# Altium project MainBoard_V1_2.PrjPcb
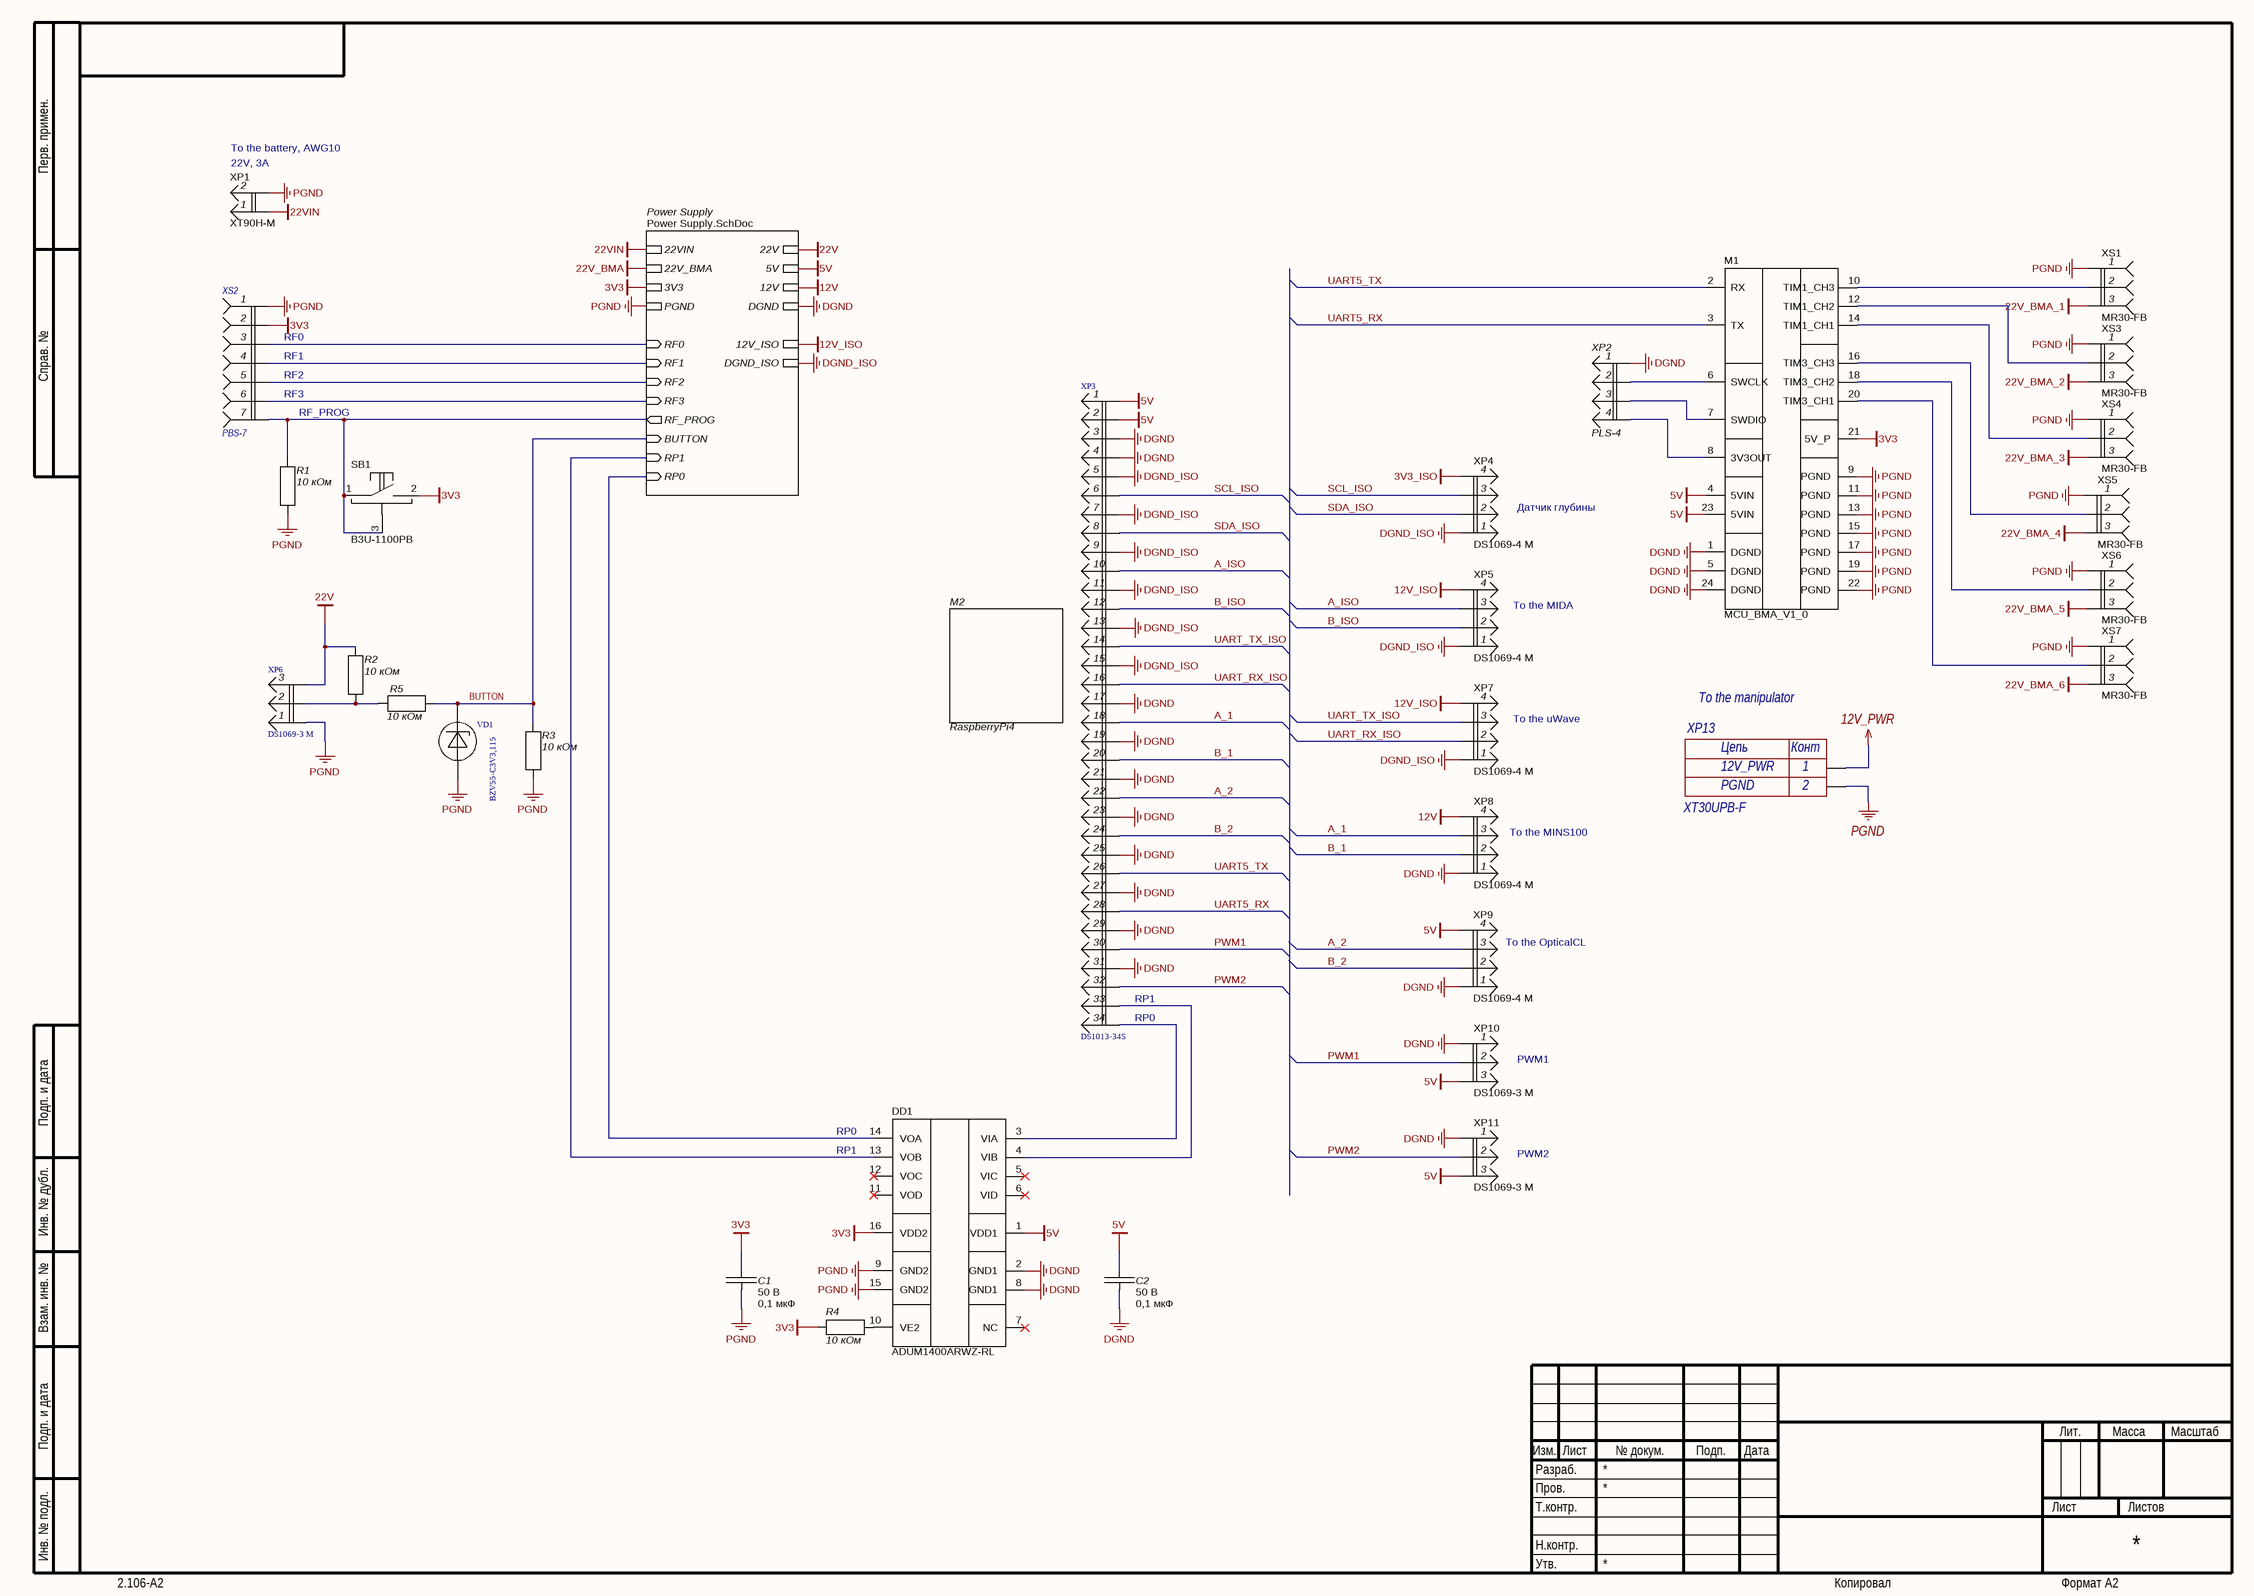
[diagram p0: Main.SchDoc]
2 sheets, 100 parts. Net scope: hierarchical (ports join the sheet entries above them; power ports are global).
Board file: MainBoard_V1_2.PcbDoc
Sheets:
  Main.SchDoc
    Power Supply = Power Supply.SchDoc

## Sheet Main.SchDoc
size 594 x 420 mm; Organization: Altium Limited; Address1: L3, 12a Rodborough Rd; Address2: Frenchs Forest; Address3: NSW; Address4: Australia 2086

### Parts
C1  Voltage: 50 В  [C0603C]  (hidden comment: 0,1 мкФ)
C2  Voltage: 50 В  [C0603C]  (hidden comment: 0,1 мкФ)
DD1  ADUM1400ARWZ-RL  [SOIC-Wide-16]
M1  MCU_BMA_V1_0  [MCU_BMA_V1_0]
M2  RaspberryPi4  [Raspberry+PI4MB_HAT_V2]
R1  10 кОм  [C0603R]
R2  10 кОм  [C0603R]
R3  10 кОм  [C0603R]
R4  10 кОм  [C0603R]
R5  10 кОм  [C0603R]
SB1  B3U-1100PB  [B3U-1100P]
VD1  BZV55-C3V3,115  [SOD80C]
XP1  XT90H-M  [XT90H-M]
XP2  PLS-4  [PLS-4]
XP3  DS1013-34S  [IDC-34MS]
XP4  DS1069-4 M  [DS1069-4 M]
XP5  DS1069-4 M  [DS1069-4 M]
XP6  DS1069-3 M  [DS1069-3 M]
XP7  DS1069-4 M  [DS1069-4 M]
XP8  DS1069-4 M  [DS1069-4 M]
XP9  DS1069-4 M  [DS1069-4 M]
XP10  DS1069-3 M  [DS1069-3 M]
XP11  DS1069-3 M  [DS1069-3 M]
XP13  XT30UPB-F  Value2: PGND  Value1: 12V_PWR  [XT30UPB-F]
XS1  MR30-FB  [MR30-FB]
XS2  PBS-7  [PBS-7]
XS3  MR30-FB  [MR30-FB]
XS4  MR30-FB  [MR30-FB]
XS5  MR30-FB  [MR30-FB]
XS6  MR30-FB  [MR30-FB]
XS7  MR30-FB  [MR30-FB]

### Sub-sheets
Power Supply = Power Supply.SchDoc: 22VIN, 22V, PGND, DGND, DGND_ISO, 12V, 5V, 12V_ISO, RF1 (in), RF2 (in), RF3 (in), BUTTON (in), RP1 (in), RP0 (in), 3V3, RF0 (in), 22V_BMA, RF_PROG (out)

### Nets
3V3: C1.1 DD1.16(VDD2) M1.21(5V_P) R4.2 SB1.2 XS2.2 ; sheet Power Supply/3V3
3V3_ISO: XP4.4
5V: C2.1 DD1.1(VDD1) M1.4(5VIN) M1.23(5VIN) XP3.1 XP3.2 XP9.4 XP10.3 XP11.3 ; sheet Power Supply/5V
12V: XP8.4 ; sheet Power Supply/12V
12V_ISO: XP5.4 XP7.4 ; sheet Power Supply/12V_ISO
12V_PWR: XP13.P
22V: R2.1 XP6.3 ; sheet Power Supply/22V
22V_BMA: sheet Power Supply/22V_BMA
22V_BMA_1: XS1.3
22V_BMA_2: XS3.3
22V_BMA_3: XS4.3
22V_BMA_4: XS5.3
22V_BMA_5: XS6.3
22V_BMA_6: XS7.3
22VIN: XP1.1 ; sheet Power Supply/22VIN
DGND: C2.2 DD1.2(GND1) DD1.8(GND1) M1.1(DGND) M1.5(DGND) M1.24(DGND) XP2.1 XP3.3 XP3.4 XP3.17 XP3.19 XP3.21 XP3.23 XP3.25 XP3.27 XP3.29 XP3.31 XP8.1 XP9.1 XP10.1 XP11.1 ; sheet Power Supply/DGND
DGND_ISO: XP3.5 XP3.7 XP3.9 XP3.11 XP3.13 XP3.15 XP4.1 XP5.1 XP7.1 ; sheet Power Supply/DGND_ISO
PGND: C1.2 DD1.9(GND2) DD1.15(GND2) M1.9(PGND) M1.11(PGND) M1.13(PGND) M1.15(PGND) M1.17(PGND) M1.19(PGND) M1.22(PGND) R1.2 R3.2 VD1.2(ANODE) XP1.2 XP6.1 XP13.N XS1.1 XS2.1 XS3.1 XS4.1 XS5.1 XS6.1 XS7.1 ; sheet Power Supply/PGND
A_1: XP3.18 XP8.3
A_2: XP3.22 XP9.3
A_ISO: XP3.10 XP5.3
B_1: XP3.20 XP8.2
B_2: XP3.24 XP9.2
B_ISO: XP3.12 XP5.2
BUTTON: R3.1 R5.2 VD1.1(CATHODE) ; sheet Power Supply/BUTTON
PWM1: XP3.30 XP10.2
PWM2: XP3.32 XP11.2
RF0: XS2.3 ; sheet Power Supply/RF0
RF1: XS2.4 ; sheet Power Supply/RF1
RF2: XS2.5 ; sheet Power Supply/RF2
RF3: XS2.6 ; sheet Power Supply/RF3
RF_PROG: R1.1 SB1.1 SB1.3 XS2.7 ; sheet Power Supply/RF_PROG
RP0: DD1.14(VOA) ; sheet Power Supply/RP0
RP1: DD1.13(VOB) ; sheet Power Supply/RP1
SCL_ISO: XP3.6 XP4.3
SDA_ISO: XP3.8 XP4.2
UART5_RX: M1.3(TX) XP3.28
UART5_TX: M1.2(RX) XP3.26
UART_RX_ISO: XP3.16 XP7.2
UART_TX_ISO: XP3.14 XP7.3
NetDD1_3: DD1.3(VIA) XP3.34
NetDD1_4: DD1.4(VIB) XP3.33
NetDD1_10: DD1.10(VE2) R4.1
NetM1_6: M1.6(SWCLK) XP2.2
NetM1_7: M1.7(SWDIO) XP2.3
NetM1_8: M1.8(3V3OUT) XP2.4
NetM1_10: M1.10(TIM1_CH3) XS1.2
NetM1_12: M1.12(TIM1_CH2) XS3.2
NetM1_14: M1.14(TIM1_CH1) XS4.2
NetM1_16: M1.16(TIM3_CH3) XS5.2
NetM1_18: M1.18(TIM3_CH2) XS6.2
NetM1_20: M1.20(TIM3_CH1) XS7.2
NetR2_2: R2.2 R5.1 XP6.2

Not connected (* = marked no-connect by the designer): DD1 5(VIC)* 6(VID)* 7(NC)* 11(VOD)* 12(VOC)*

### Notes on the sheet
- (near XP1) To the battery, AWG10
- (near XP1) 22V, 3A
- RF0
- RF1
- RF2
- RF3
- RF_PROG
- (near XP4) Датчик глубины
- (near XP5) To the MIDA
- (near XP7) To the uWave
- To the manipulator
- (near XP8) To the MINS100
- (near XP9) To the OpticalCL
- RP1
- RP0
- (near XP10) PWM1
- (near XP11) PWM2
- Перв. примен.
- Справ. №
- Подп. и дата
- Инв. № дубл.
- Взам. инв. №
- Разраб.
- Изм.
- Лист
- № докум.
- Подп.
- Дата
- Лит.
- Масса
- Масштаб
- Пров.
- Т.контр.
- Листов
- Инв. № подл.
- Утв.
- Н.контр.
- 2.106-A2
- Копировал
- Формат А2
- (in symbol XT30UPB-F) Цепь; Конт; 1; 2

### Library data of the parts
C1 C2 = CC0603KRX7R9BB104: SMD 0603 ; X7R; 0,1 мкФ; 50 В; Manufacturer: YAGEO; Persent: ±5%; Type: Ceramic; Part Number: CC0603KRX7R9BB104; Package: SMD 0603; Dielectric: X7R; ComponentLink1Description: Datasheet; Value: 0,1 мкФ
DD1 = ADUM1400ARWZ-RL: ISO; Manufacturer: Analog Devices; Part Number: ADUM1400ARWZ-RL; Type: ISO
M1 = MCU_BMA_V1_0: MCU_BMA_V1_0, user module; Type: User
M2 = Raspberry+PI4MB_HAT_V2: Part Number: RaspberryPi4; Type: User; ComponentLink1Description: Datasheet; Manufacturer: Raspberry
R1-R5 = RC0603FR-0710KL: SMD 0603; 0,1; 1%; 10 кОм; Manufacturer: Yageo; Power: 0,1; Part Number: RC0603FR-0710KL; Package: SMD 0603; Persent: 1%; Value: 10 кОм; Category: R
SB1 = B3U-1100PB: SB; Manufacturer: OMRON; Part Number: B3U-1100PB; Type: SB
VD1 = BZV55-C3V3,115: Zener, 3,3В; Manufacturer: Nexperia; Part Number: BZV55-C3V3,115; Type: Zener
XP1 = XT90H-M: Manufacturer: AMASS; Part Number: XT90H-M; Type: XT
XP3 = DS1013-34S: IDC; Manufacturer: Connfly; Part Number: DS1013-34S; Type: IDC
XP4 XP5 XP7-XP9 = DS1069-4 M: Manufacturer: Connfly; Part Number: DS1069-4 M; Type: XH
XP6 XP10 XP11 = DS1069-3 M: Manufacturer: Connfly; Part Number: DS1069-3 M; Type: XH
XP13 = XT30UPB-F: 30 А (15 продолжительно), прямая мать; Part Number: XT30UPB-F
XS1 XS3-XS7 = MR30-FB: Manufacturer: AMASS; Part Number: MR30-FB; Type: XT
XP2 = PLS-4: Part Number: PLS-4; Type: PLS; ComponentLink1Description: Datasheet; Manufacturer: -
XS2 = PBS-7: Part Number: PBS-7; Type: PBS; ComponentLink1Description: Datasheet; Manufacturer: -

## Sheet Power Supply.SchDoc
size A1; Organization: Altium Limited; Address1: L3, 12a Rodborough Rd; Address2: Frenchs Forest; Address3: NSW; Address4: Australia 2086
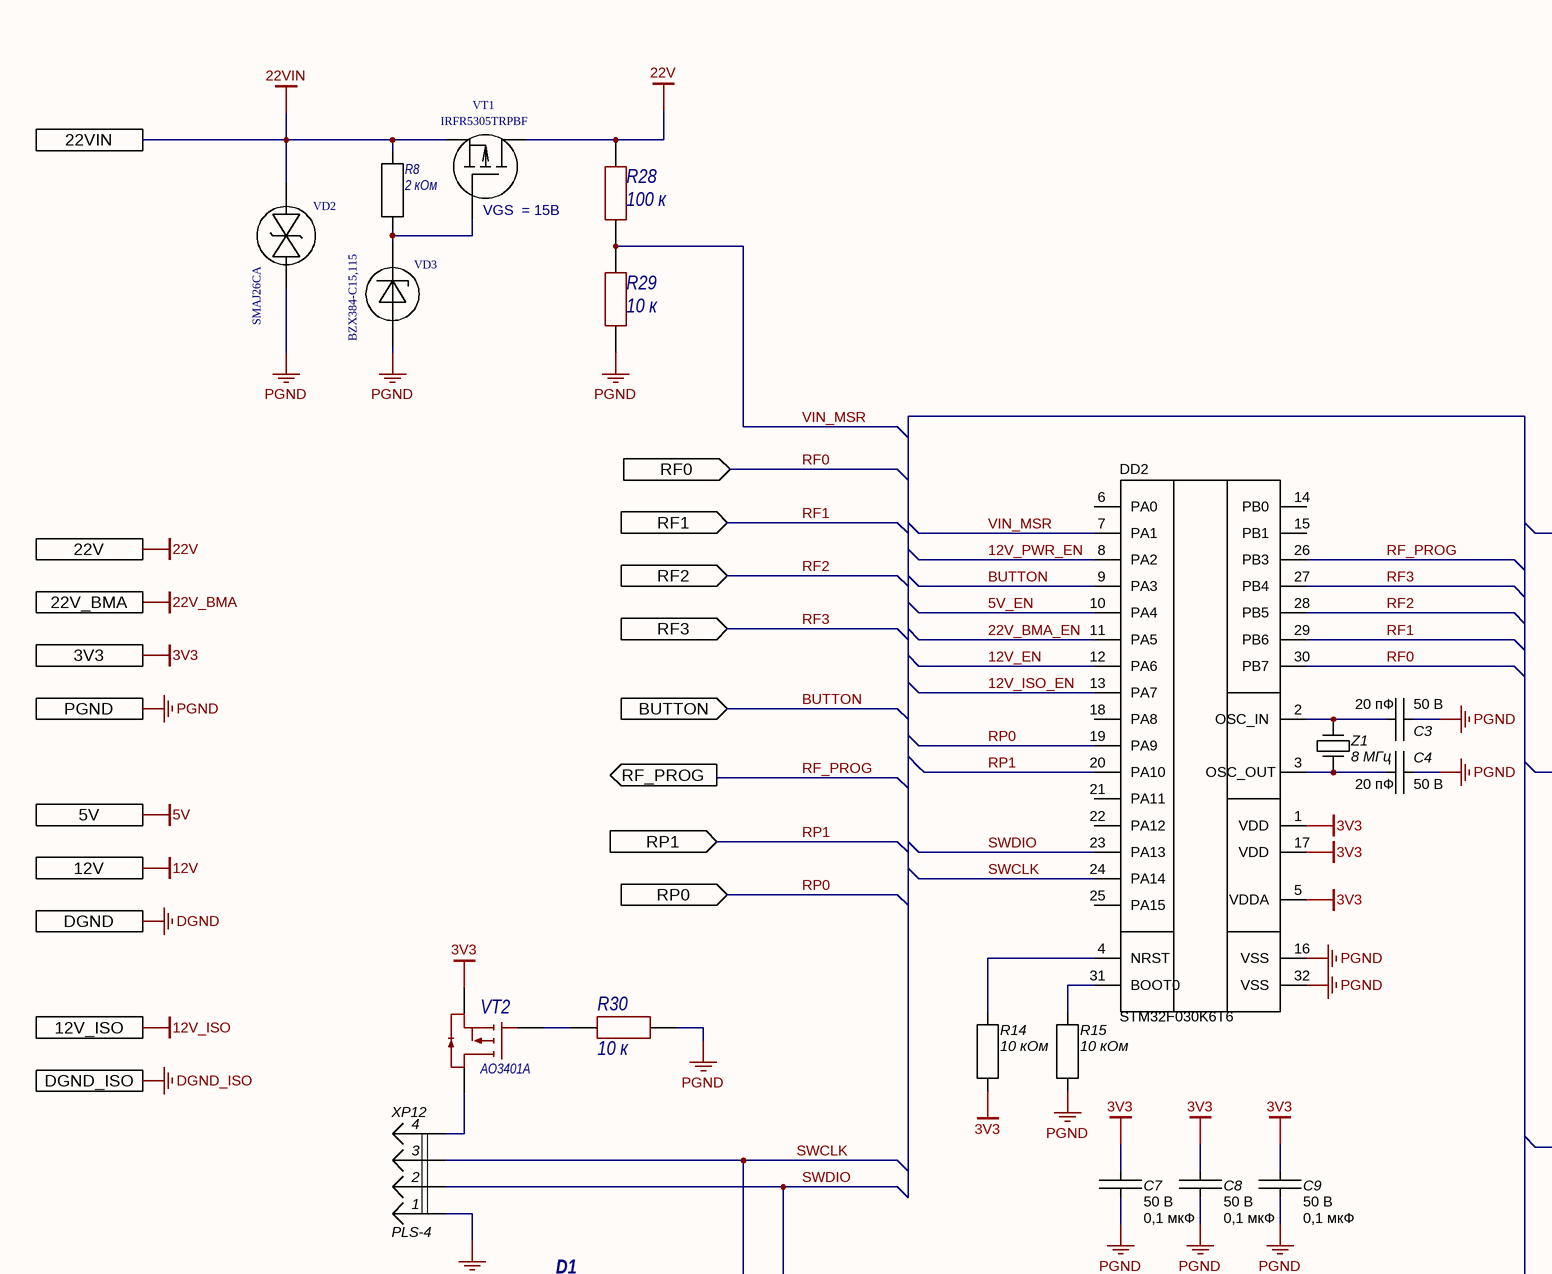
[diagram p1: Power Supply.SchDoc, top left]
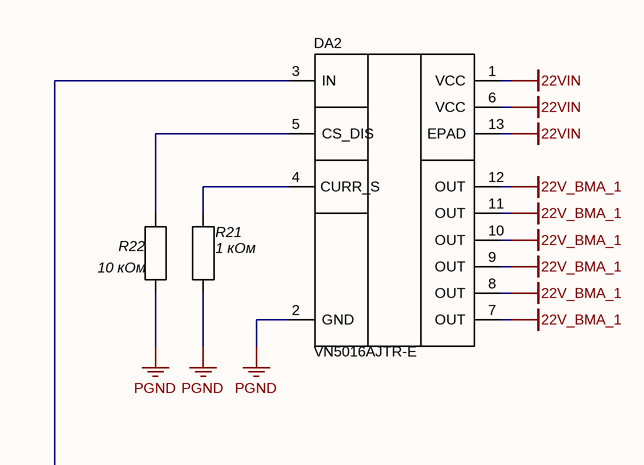
[diagram p2: Power Supply.SchDoc, top right]
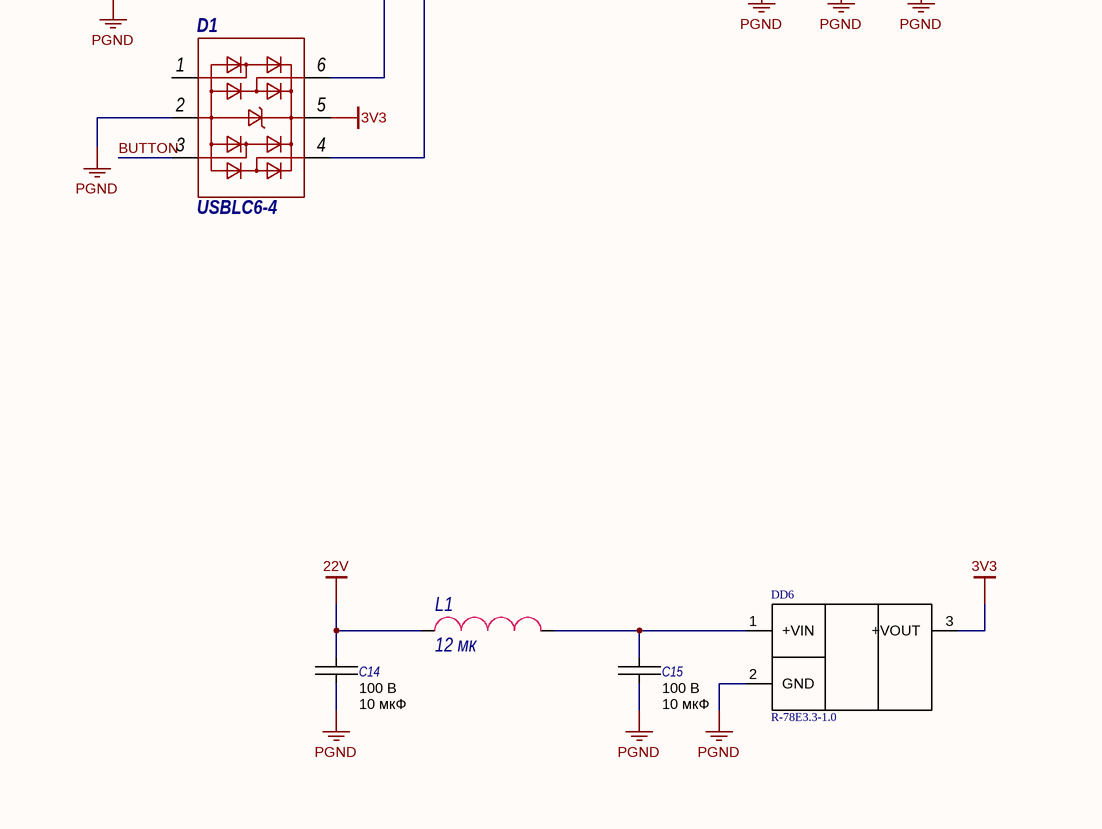
[diagram p3: Power Supply.SchDoc, bottom left]
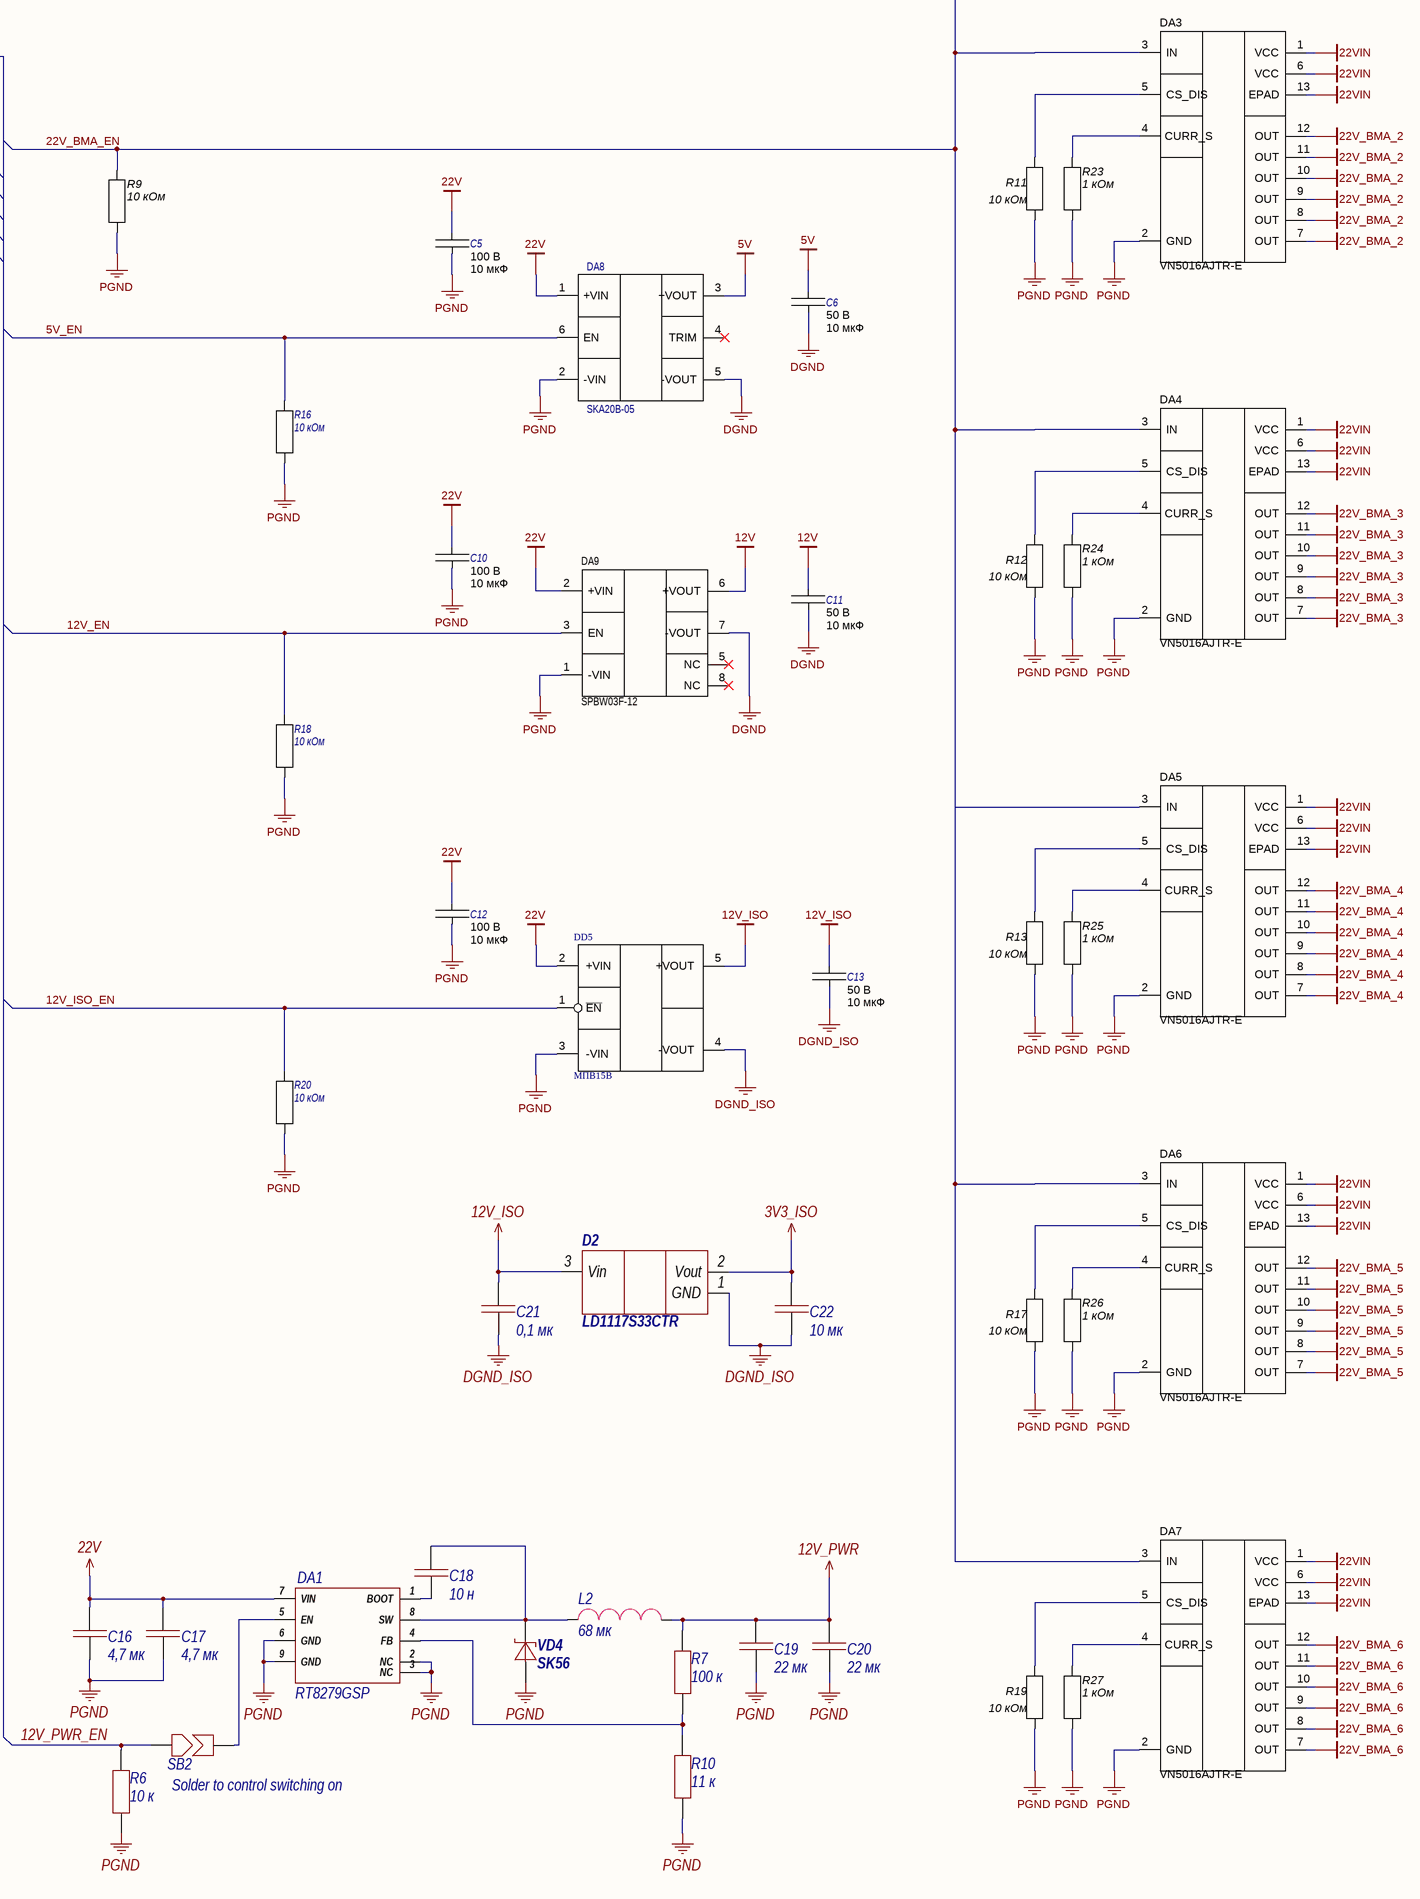
[diagram p4: Power Supply.SchDoc, bottom right]

### Parts
C3  Voltage: 50 В  [C0603C]  (hidden comment: 20 пФ)
C4  Voltage: 50 В  [C0603C]  (hidden comment: 20 пФ)
C5  Voltage: 100 В  [C2220C]  (hidden comment: 10 мкФ)
C6  Voltage: 50 В  [C1210C]  (hidden comment: 10 мкФ)
C7  Voltage: 50 В  [C0603C]  (hidden comment: 0,1 мкФ)
C8  Voltage: 50 В  [C0603C]  (hidden comment: 0,1 мкФ)
C9  Voltage: 50 В  [C0603C]  (hidden comment: 0,1 мкФ)
C10  Voltage: 100 В  [C2220C]  (hidden comment: 10 мкФ)
C11  Voltage: 50 В  [C1210C]  (hidden comment: 10 мкФ)
C12  Voltage: 100 В  [C2220C]  (hidden comment: 10 мкФ)
C13  Voltage: 50 В  [C1210C]  (hidden comment: 10 мкФ)
C14  Voltage: 100 В  [C2220C]  (hidden comment: 10 мкФ)
C15  Voltage: 100 В  [C2220C]  (hidden comment: 10 мкФ)
C16  value 4,7 мк  [1206C]  (hidden comment: Capacitor)
C17  value 4,7 мк  [1206C]  (hidden comment: Capacitor)
C18  value 10 н  [0603C]  (hidden comment: Capacitor)
C19  value 22 мк  [1210C]  (hidden comment: Capacitor)
C20  value 22 мк  [1210C]  (hidden comment: Capacitor)
C21  value 0,1 мк  [0603C]  (hidden comment: Capacitor)
C22  value 10 мк  [1210C]  (hidden comment: Capacitor)
D1  USBLC6-4  [SOT23-6]
D2  LD1117S33CTR  [SOT223]
DA1  RT8279GSP  [8SOP(Exposed_Pad)]
DA2  VN5016AJTR-E  [PowerSSO-12]
DA3  VN5016AJTR-E  [PowerSSO-12]
DA4  VN5016AJTR-E  [PowerSSO-12]
DA5  VN5016AJTR-E  [PowerSSO-12]
DA6  VN5016AJTR-E  [PowerSSO-12]
DA7  VN5016AJTR-E  [PowerSSO-12]
DA8  SKA20B-05  [SKA20B05]
DA9  SPBW03F-12  [SIP8]
DD2  STM32F030K6T6  [LQFP32]
DD5  МПВ15В  [МП_15_]
DD6  R-78E3.3-1.0  [SIP3]
L1  value 12 мк  [4.5x4_wired]  (hidden comment: SDR0403-120ML)
L2  value 68 мк  [12.5x12.5]  (hidden comment: B82477R4683M100)
R6  value 10 к  [0603R]  (hidden comment: Resistor)
R7  value 100 к  [0603R]  (hidden comment: Resistor)
R8  2 кОм  [C0603R]
R9  10 кОм  [C0603R]
R10  value 11 к  [0603R]  (hidden comment: Resistor)
R11  10 кОм  [C0603R]
R12  10 кОм  [C0603R]
R13  10 кОм  [C0603R]
R14  10 кОм  [C0603R]
R15  10 кОм  [C0603R]
R16  10 кОм  [C0603R]
R17  10 кОм  [C0603R]
R18  10 кОм  [C0603R]
R19  10 кОм  [C0603R]
R20  10 кОм  [C0603R]
R21  1 кОм  [C0603R]
R22  10 кОм  [C0603R]
R23  1 кОм  [C0603R]
R24  1 кОм  [C0603R]
R25  1 кОм  [C0603R]
R26  1 кОм  [C0603R]
R27  1 кОм  [C0603R]
R28  value 100 к  [0603R]  (hidden comment: Resistor)
R29  value 10 к  [0603R]  (hidden comment: Resistor)
R30  value 10 к  [0603R]  (hidden comment: Resistor)
SB2  SB  [0805SB]  (value not drawn)
VD2  SMAJ26CA  [DO-214AC]
VD3  BZX384-C15,115  [SOD-123]
VD4  SK56  [SMC]
VT1  IRFR5305TRPBF  [D-PAK]
VT2  AO3401A  [SOT23-3]
XP12  PLS-4  [PLS-4]
Z1  8 МГц  [HC-49SM]

### Ports
3V3, 5V, 12V, 12V_ISO, 22V, 22V_BMA, 22VIN, BUTTON (in), DGND, DGND_ISO, PGND, RF0 (in), RF1 (in), RF2 (in), RF3 (in), RF_PROG (out), RP0 (in), RP1 (in)

### Nets
3V3: C7.1 C8.1 C9.1 D1.5 DD2.1(VDD) DD2.5(VDDA) DD2.17(VDD) DD6.3(+VOUT) R14.1 VT2.2 ; port 3V3
3V3_ISO: C22.2 D2.2(Vout)
5V: C6.1 DA8.3(+VOUT) ; port 5V
12V: C11.1 DA9.6(+VOUT) ; port 12V
12V_ISO: C13.1 C21.2 D2.3(Vin) DD5.5(+VOUT) ; port 12V_ISO
12V_PWR: C19.2 C20.2 L2.2 R7.2
22V: C5.1 C10.1 C12.1 C14.1 C16.2 C17.2 DA1.7(VIN) DA8.1(+VIN) DA9.2(+VIN) DD5.2(+VIN) L1.1 R28.2 VT1.2(D) ; port 22V
22V_BMA: port 22V_BMA
22V_BMA_1: DA2.7(OUT) DA2.8(OUT) DA2.9(OUT) DA2.10(OUT) DA2.11(OUT) DA2.12(OUT)
22V_BMA_2: DA3.7(OUT) DA3.8(OUT) DA3.9(OUT) DA3.10(OUT) DA3.11(OUT) DA3.12(OUT)
22V_BMA_3: DA4.7(OUT) DA4.8(OUT) DA4.9(OUT) DA4.10(OUT) DA4.11(OUT) DA4.12(OUT)
22V_BMA_4: DA5.7(OUT) DA5.8(OUT) DA5.9(OUT) DA5.10(OUT) DA5.11(OUT) DA5.12(OUT)
22V_BMA_5: DA6.7(OUT) DA6.8(OUT) DA6.9(OUT) DA6.10(OUT) DA6.11(OUT) DA6.12(OUT)
22V_BMA_6: DA7.7(OUT) DA7.8(OUT) DA7.9(OUT) DA7.10(OUT) DA7.11(OUT) DA7.12(OUT)
22VIN: DA2.1(VCC) DA2.6(VCC) DA2.13(EPAD) DA3.1(VCC) DA3.6(VCC) DA3.13(EPAD) DA4.1(VCC) DA4.6(VCC) DA4.13(EPAD) DA5.1(VCC) DA5.6(VCC) DA5.13(EPAD) DA6.1(VCC) DA6.6(VCC) DA6.13(EPAD) DA7.1(VCC) DA7.6(VCC) DA7.13(EPAD) R8.1 VD2.1(C) VT1.3(S) ; port 22VIN
DGND: C6.2 C11.2 DA8.5(-VOUT) DA9.7(-VOUT) ; port DGND
DGND_ISO: C13.2 C21.1 C22.1 D2.1(GND) DD5.4(-VOUT) ; port DGND_ISO
PGND: C3.1 C4.1 C5.2 C7.2 C8.2 C9.2 C10.2 C12.2 C14.2 C15.2 C16.1 C17.1 C19.1 C20.1 D1.2 DA1.2(NC) DA1.3(NC) DA1.6(GND) DA1.9(GND) DA2.2(GND) DA3.2(GND) DA4.2(GND) DA5.2(GND) DA6.2(GND) DA7.2(GND) DA8.2(-VIN) DA9.1(-VIN) DD2.16(VSS) DD2.32(VSS) DD5.3(-VIN) DD6.2(GND) R6.1 R9.2 R10.2 R11.2 R12.2 R13.2 R15.1 R16.1 R17.2 R18.1 R19.2 R20.1 R21.2 R22.2 R23.2 R24.2 R25.2 R26.2 R27.2 R29.1 R30.1 VD2.2(A) VD3.2(ANODE) VD4.1 XP12.1 ; port PGND
5V_EN: DA8.6(EN) DD2.10(PA4) R16.2
12V_EN: DA9.3(EN) DD2.12(PA6) R18.2
12V_ISO_EN: DD2.13(PA7) DD5.1(~{EN}) R20.2
12V_PWR_EN: DD2.8(PA2) R6.2 SB2.2
22V_BMA_EN: DA2.3(IN) DA3.3(IN) DA4.3(IN) DA5.3(IN) DA6.3(IN) DA7.3(IN) DD2.11(PA5) R9.1
BUTTON: D1.3 DD2.9(PA3) ; port BUTTON
RF0: DD2.30(PB7) ; port RF0
RF1: DD2.29(PB6) ; port RF1
RF2: DD2.28(PB5) ; port RF2
RF3: DD2.27(PB4) ; port RF3
RF_PROG: DD2.26(PB3) ; port RF_PROG
RP0: DD2.19(PA9) ; port RP0
RP1: DD2.20(PA10) ; port RP1
SWCLK: D1.6 DD2.24(PA14) XP12.3
SWDIO: D1.4 DD2.23(PA13) XP12.2
VIN_MSR: DD2.7(PA1) R28.1 R29.2
NetC3_2: C3.2 DD2.2(OSC_IN) Z1.2(OSC2)
NetC4_2: C4.2 DD2.3(OSC_OUT) Z1.1(OSC1)
NetC15_1: C15.1 DD6.1(+VIN) L1.2
NetC18_1: C18.1 DA1.1(BOOT)
NetC18_2: C18.2 DA1.8(SW) L2.1 VD4.2
NetDA1_4: DA1.4(FB) R7.1 R10.1
NetDA1_5: DA1.5(EN) SB2.1
NetDA2_4: DA2.4(CURR_S) R21.1
NetDA2_5: DA2.5(CS_DIS) R22.1
NetDA3_4: DA3.4(CURR_S) R23.1
NetDA3_5: DA3.5(CS_DIS) R11.1
NetDA4_4: DA4.4(CURR_S) R24.1
NetDA4_5: DA4.5(CS_DIS) R12.1
NetDA5_4: DA5.4(CURR_S) R25.1
NetDA5_5: DA5.5(CS_DIS) R13.1
NetDA6_4: DA6.4(CURR_S) R26.1
NetDA6_5: DA6.5(CS_DIS) R17.1
NetDA7_4: DA7.4(CURR_S) R27.1
NetDA7_5: DA7.5(CS_DIS) R19.1
NetDD2_4: DD2.4(NRST) R14.2
NetDD2_31: DD2.31(BOOT0) R15.2
NetR8_2: R8.2 VD3.1(CATHODE) VT1.1(G)
NetR30_2: R30.2 VT2.1
NetVT2_3: VT2.3 XP12.4

Not connected (* = marked no-connect by the designer): D1 1(9); DA8 4(TRIM)*; DA9 5(NC)* 8(NC)*; DD2 6(PA0) 14(PB0) 15(PB1) 18(PA8) 21(PA11) 22(PA12) 25(PA15)

### Notes on the sheet
- (near VT1) VGS  = 15В
- Solder to control switching on
- Перв. примен.
- Справ. №
- Подп. и дата
- Инв. № дубл.
- Взам. инв. №
- Инв. № подл.
- Изм.
- Лист
- № докум.
- Подп.
- Дата
- 2.106-A2
- Копировал
- Формат А2

### Library data of the parts
C3 C4 = CC0603JRNPO9BN200: SMD 0603 ; C0G(NP0); 20 пФ; 50 В; Manufacturer: YAGEO; Persent: ±15%; Type: Ceramic; Part Number: CC0603JRNPO9BN200; Package: SMD 0603; Dielectric: C0G(NP0); ComponentLink1Description: Datasheet; Value: 20 пФ
C5 C10 C12 C14 C15 = 22201C106MAT2A: SMD 2220 ; X7R; 10 мкФ; 100 В; Manufacturer: AVX; Persent: ±15%; Type: Ceramic; Part Number: 22201C106MAT2A; Package: SMD 2220; Dielectric: X7R; ComponentLink1Description: Datasheet; Value: 10 мкФ
C6 C11 C13 = 12105C106KAT2A: SMD 1210; X7R; 10 мкФ; 50 В; Manufacturer: AVX; Persent: ±15%; Type: Ceramic; Part Number: 12105C106KAT2A; Package: SMD 1210; Dielectric: X7R; ComponentLink1Description: Datasheet; Value: 10 мкФ
C7-C9 = CC0603KRX7R9BB104: as C1 on sheet Main; Part Number: CC0603KRX7R9BB104; Package: SMD 0603; Dielectric: X7R; ComponentLink1Description: Datasheet; Value: 0,1 мкФ
C16 C17 = Capacitor_4,7u_10_50V_X7R_1206C: Конденсатор; Tolerance: 0,1; Voltage (V): 50; Dielectric: X7R; Capacity (nF): 4700; Part Number: Capacitor_4,7u_10_50V_X7R_1206C
C18 = Capacitor_10n_10_50V_X7R_0603C: Конденсатор; Tolerance: 0,1; Voltage (V): 50; Dielectric: X7R; Capacity (nF): 10; Part Number: Capacitor_10n_10_50V_X7R_0603C
C19 C20 = Capacitor_22u_10_25V_X7R_1210C: Конденсатор; Tolerance: 0,1; Voltage (V): 25; Dielectric: X7R; Capacity (nF): 22000; Part Number: Capacitor_22u_10_25V_X7R_1210C
C21 = Capacitor_0,1u_10_50V_X7R_0603C: Конденсатор; Tolerance: 0,1; Voltage (V): 50; Dielectric: X7R; Capacity (nF): 100; Part Number: Capacitor_0,1u_10_50V_X7R_0603C
C22 = Capacitor_10u_10_35V_X7R_1210C: Конденсатор; Tolerance: 0,1; Voltage (V): 35; Dielectric: X7R; Capacity (nF): 10000; Part Number: Capacitor_10u_10_35V_X7R_1210C
D1 = USBLC6-4: Сборка защитных диодов для USB; ComponentLink1Description: Shop; ComponentLink1URL: https://www.chipdip.ru/product0/8001780508; Part Number: USBLC6-4
D2 = LD1117S33CTR: Линейный стабилизатор напряжения; Part Number: LD1117S33CTR
DA1 = RT8279GSP: Преобразователь постоянного тока понижающий подстраиваемый выход 5А; Part Number: RT8279GSP
DA2-DA7 = VN5016AJTR-E: High Current Power Switch; Manufacturer: STMicroelectronics; Part Number: VN5016AJTR-E; Type: Power Switch
DA8 = Component_1: SKA20B-05, DC/DC преобразователь, 20Вт, вход 18-36В,выход 5В/4А
DA9 = SPBW03F-12: SPBW03F-12, DC/DC преобразователь, 3Вт, вход 9-36В,выход 12В/0.25А
DD2 = STM32F030K6T6: Manufacturer: STMicroelectronics; Part Number: STM32F030K6T6; Type: MCU
DD5 = МПВ15В: Switching regulator, Uвх = 27В, Uвых =12V; Manufacturer: ИРБИС; Part Number: МПВ15В; Type: ISO DC/DC
DD6 = R-78E3.3-1.0: DC/DC, 24VIN 3V3 OUT; Manufacturer: Recom; Part Number: R-78E3.3-1.0; Type: DC/DC
L1 = SDR0403-120ML: Индуктивность на 12 мкГн, номинальный ток 1,05 A; Inductance (μH): 12; Current (A): 1,05; Part Number: SDR0403-120ML
L2 = B82477R4683M100: Индуктивность на 68 мкГн, номинальный ток 2,65 A; Inductance (μH): 68; Current (A): 2,65; Part Number: B82477R4683M100
R6 R29 R30 = Resistor_10k_1_0603: Резистор номиналом 10 кОм и точностью 1%; Power: *; Part Number: Resistor_10k_1_0603; Tolerance: 1%
R7 R28 = Resistor_100k_1_0603: Резистор номиналом 100 кОм и точностью 1%; Power: *; Part Number: Resistor_100k_1_0603; Tolerance: 1%
R8 = RC0603FR-072KL: SMD 0603; 0,1; 1%; 2 кОм; Manufacturer: Yageo; Power: 0,1; Part Number: RC0603FR-072KL; Package: SMD 0603; Persent: 1%; Value: 2 кОм; Category: R
R9 R11-R20 R22 = RC0603FR-0710KL: as R1 on sheet Main; Part Number: RC0603FR-0710KL; Package: SMD 0603; Persent: 1%; Value: 10 кОм; Category: R
R10 = Resistor_11k_1_0603: Резистор номиналом 11 кОм и точностью 1%; Power: *; Part Number: Resistor_11k_1_0603; Tolerance: 1%
R21 R23-R27 = RC0603FR-071KL: SMD 0603; 0,1; 1%; 1 кОм; Manufacturer: Yageo; Power: 0,1; Part Number: RC0603FR-071KL; Package: SMD 0603; Persent: 1%; Value: 1 кОм; Category: R
SB2 = SB: Solder bridge, мост припоя, запаиваемая перемычка, net tie, jumper; Part Number: SB
VD2 = SMAJ26CA: TVS 26 В; Manufacturer: BOURNS; Voltage: 26V; Power: 400W; Part Number: SMAJ26CA; Type: TVS
VD3 = BZX384-C15,115: Zener, 15В; Manufacturer: Nexperia; Part Number: BZX384-C15,115; Type: Zener
VD4 = SK56: Диод шоттки на 60 В, ном. ток 5 А; Voltage nominal (V): 60; Current (A): 5; Part Number: SK56
VT1 = IRFR5305TRPBF: P MOSFET; Manufacturer: Infineon; Part Number: IRFR5305TRPBF; Type: MOSFET; Сharacter: P
VT2 = AO3401A: P-канальный MOSFET; Part Number: AO3401A
Z1 = 8.000MHzHC-49SM: Part Number: 8.000MHzHC-49SM; Value: 8 МГц; ComponentLink1Description: Datasheet; Manufacturer: -; Type: Quartz
XP12 = PLS-4: Part Number: PLS-4; Type: PLS; ComponentLink1Description: Datasheet; Manufacturer: -

## Nets that join several sheets
3V3: Main (6 pins), Power Supply (10 pins)
3V3_ISO: Main (XP4.4), Power Supply (C22.2 D2.2)
5V: Main (9 pins), Power Supply (C6.1 DA8.3)
12V: Main (XP8.4), Power Supply (C11.1 DA9.6)
12V_ISO: Main (XP5.4 XP7.4), Power Supply (C13.1 C21.2 D2.3 DD5.5)
12V_PWR: Main (XP13.P), Power Supply (C19.2 C20.2 L2.2 R7.2)
22V: Main (R2.1 XP6.3), Power Supply (13 pins)
22V_BMA_1: Main (XS1.3), Power Supply (6 pins)
22V_BMA_2: Main (XS3.3), Power Supply (6 pins)
22V_BMA_3: Main (XS4.3), Power Supply (6 pins)
22V_BMA_4: Main (XS5.3), Power Supply (6 pins)
22V_BMA_5: Main (XS6.3), Power Supply (6 pins)
22V_BMA_6: Main (XS7.3), Power Supply (6 pins)
22VIN: Main (XP1.1), Power Supply (21 pins)
DGND: Main (21 pins), Power Supply (C6.2 C11.2 DA8.5 DA9.7)
DGND_ISO: Main (9 pins), Power Supply (5 pins)
PGND: Main (23 pins), Power Supply (56 pins)
BUTTON: Main (R3.1 R5.2 VD1.1), Power Supply (D1.3 DD2.9)
RF0: Main (XS2.3), Power Supply (DD2.30)
RF1: Main (XS2.4), Power Supply (DD2.29)
RF2: Main (XS2.5), Power Supply (DD2.28)
RF3: Main (XS2.6), Power Supply (DD2.27)
RF_PROG: Main (R1.1 SB1.1 SB1.3 XS2.7), Power Supply (DD2.26)
RP0: Main (DD1.14), Power Supply (DD2.19)
RP1: Main (DD1.13), Power Supply (DD2.20)